# EAGLE design DACFINAL (EAGLE 5.07)
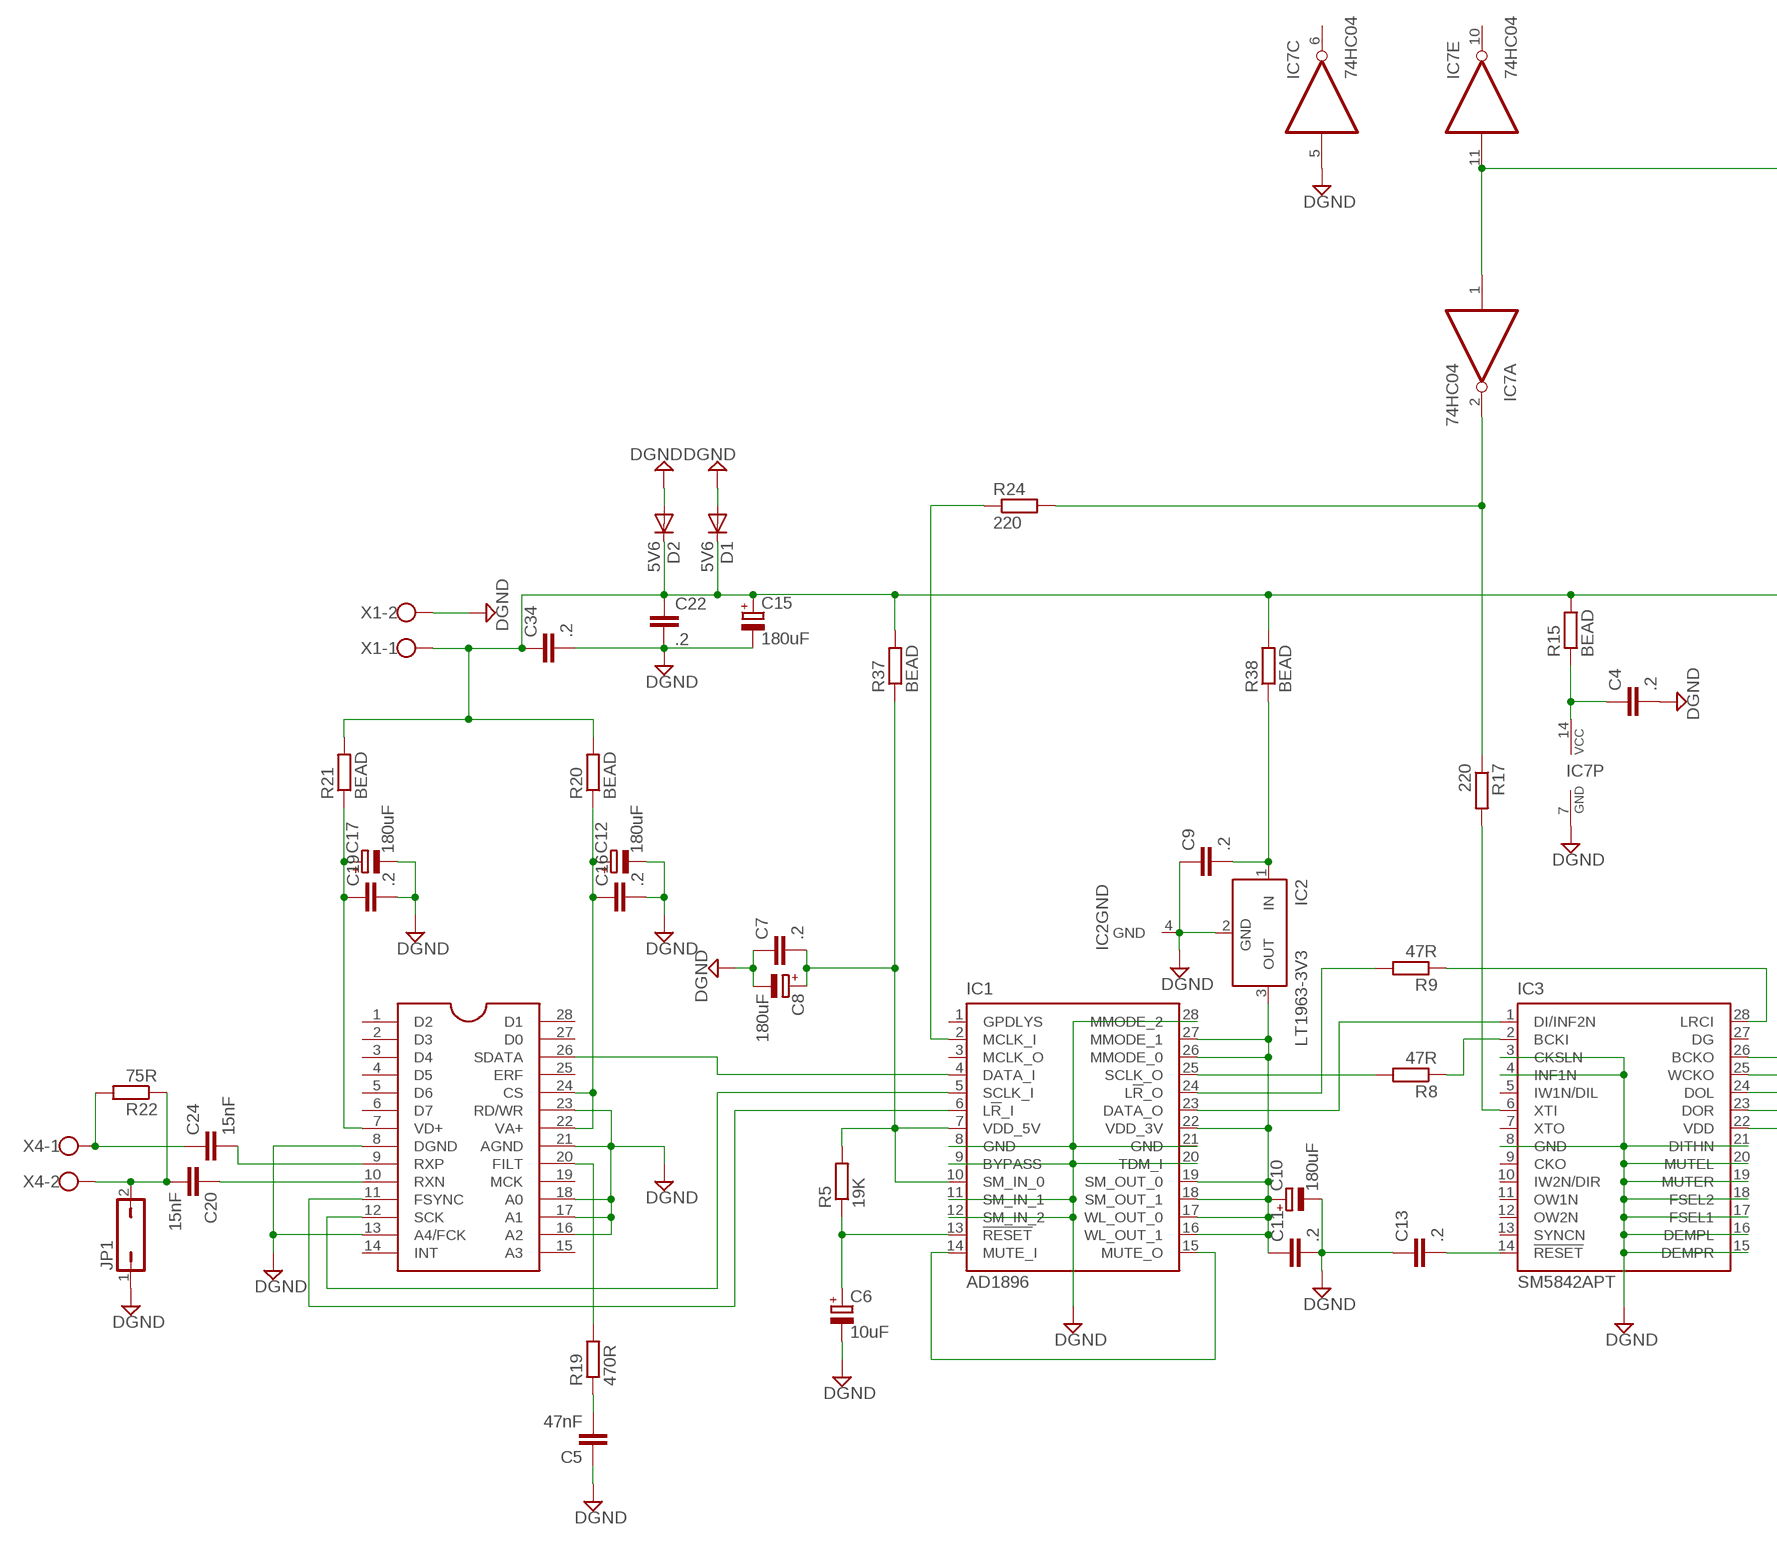
[diagram p0: schematic, sheet 1, part 1 of 2]
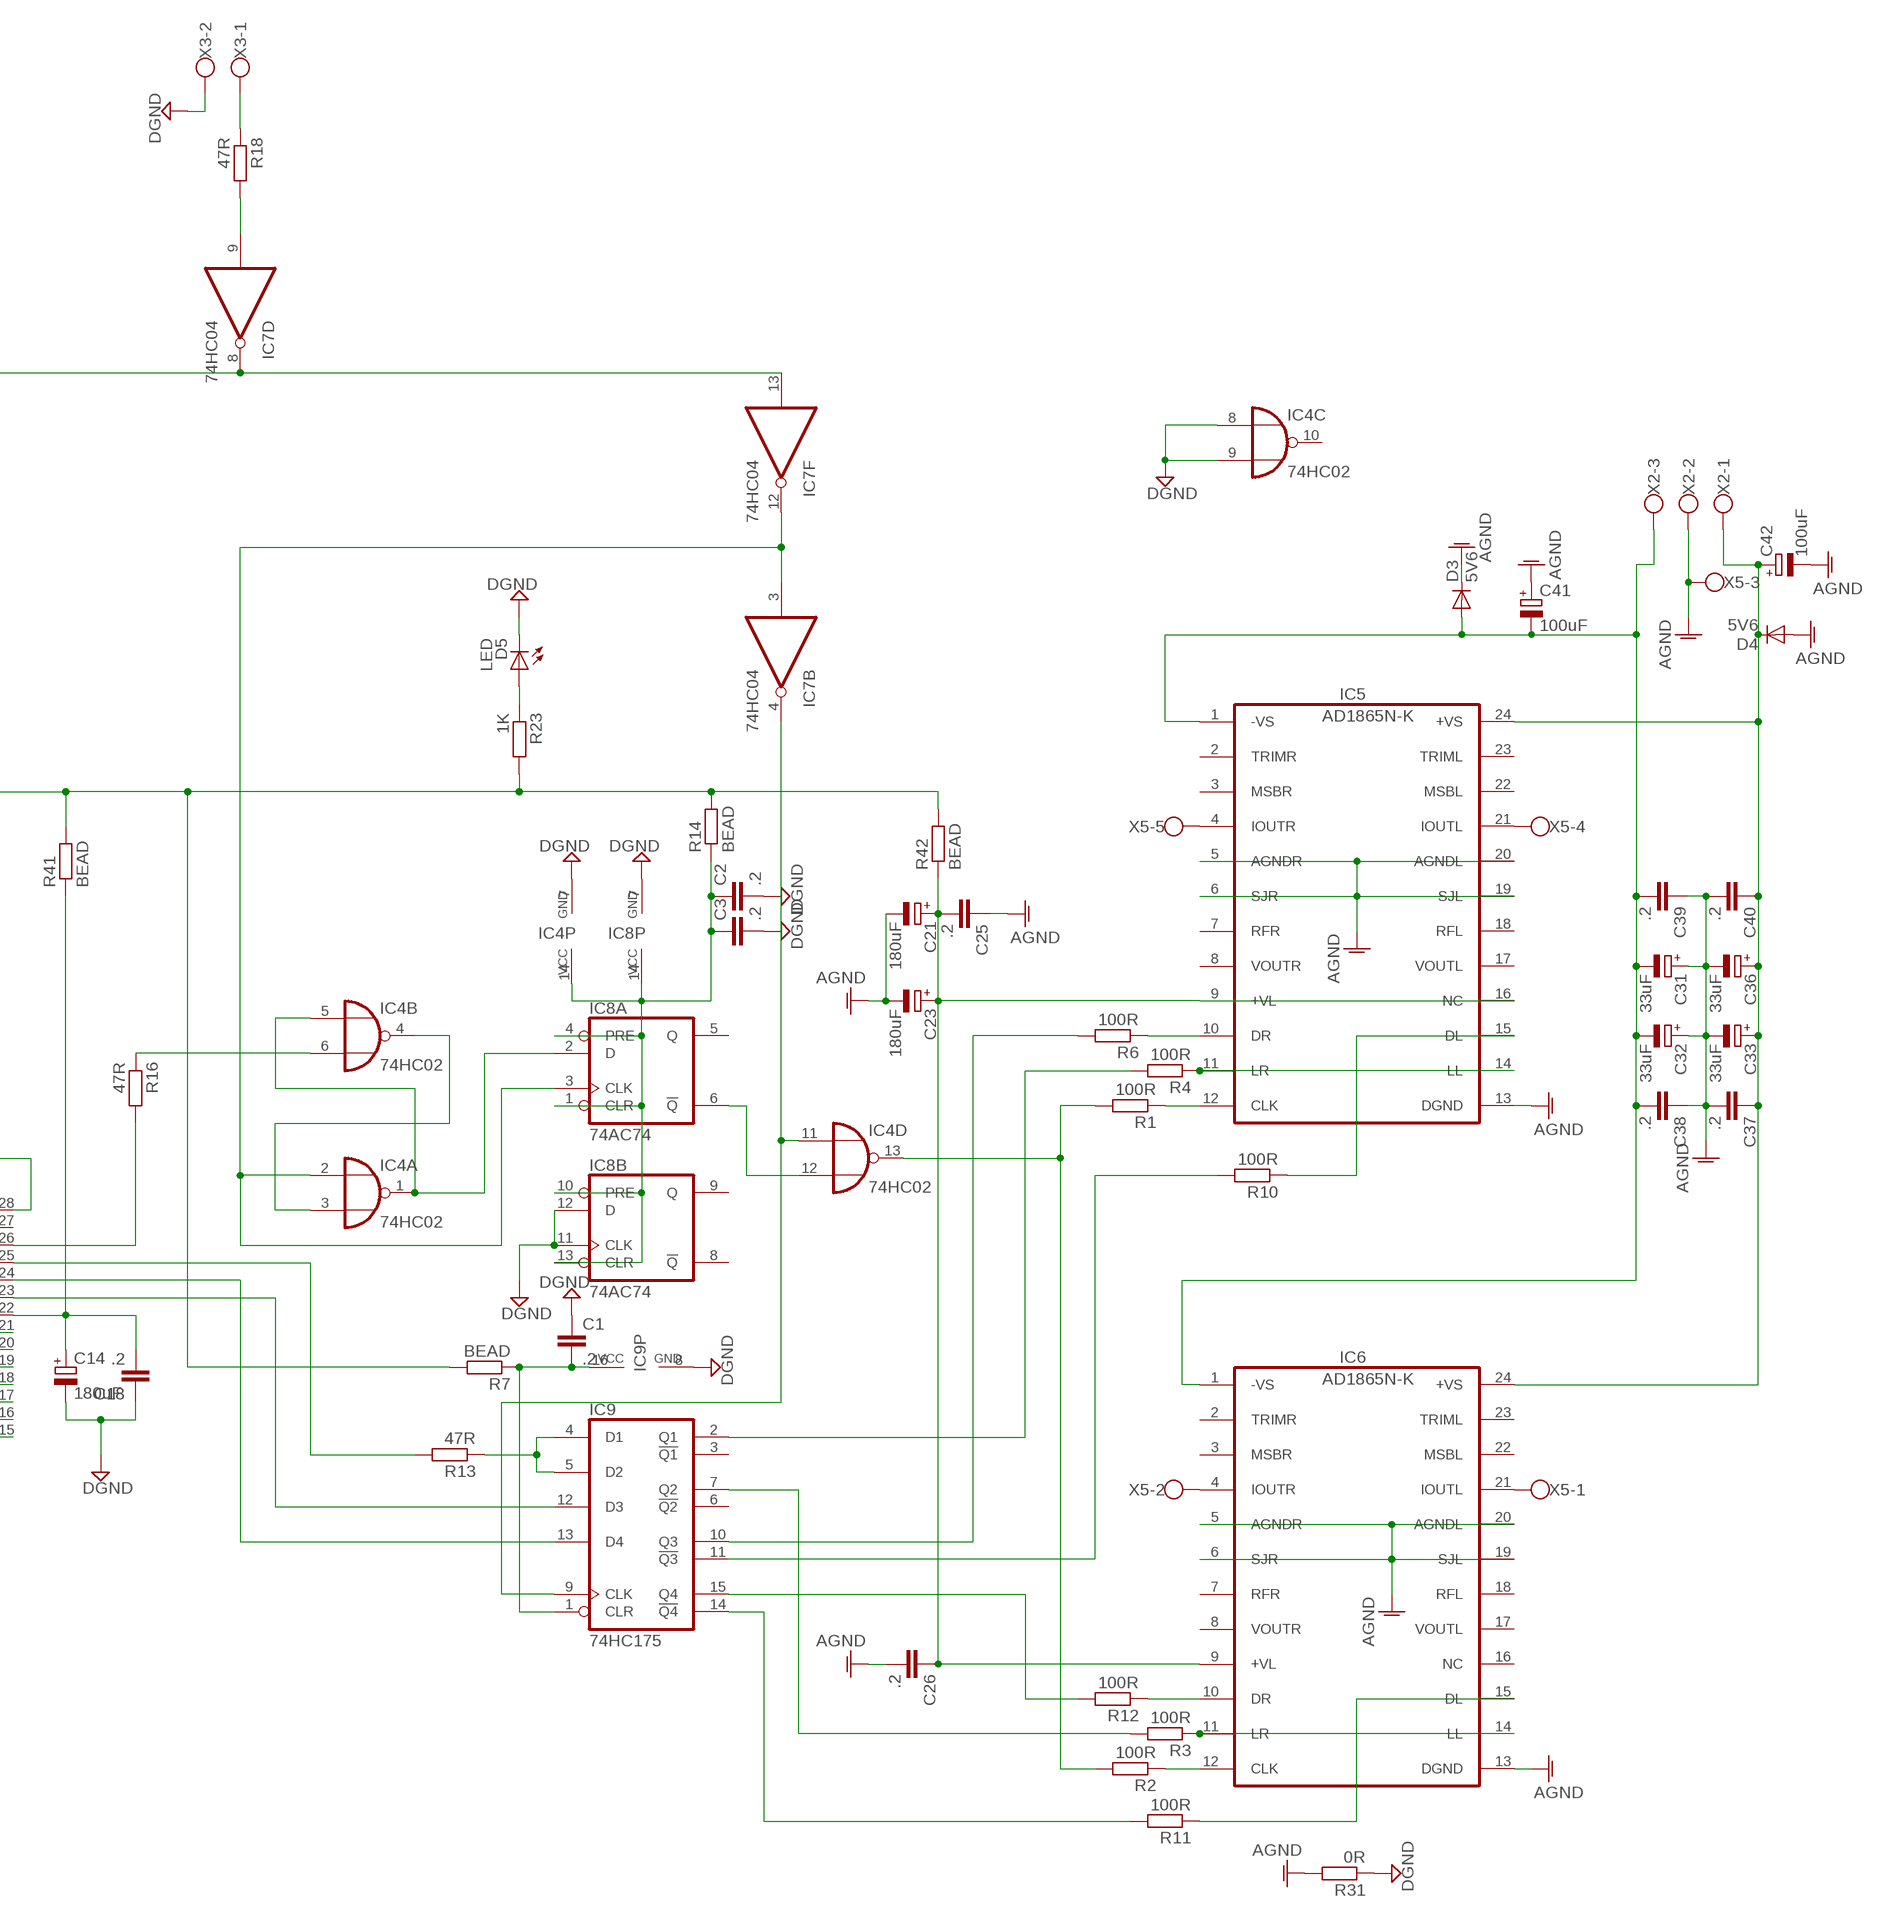
[diagram p1: schematic, sheet 1, part 2 of 2]

## Parts
C1  .2  C-EUC1210K  [C1210K]
C2  .2  C-EUC1210K  [C1210K]
C3  .2  C-EUC1210K  [C1210K]
C4  .2  C-EUC1210K  [C1210K]
C5  47nF  C-EU050-075X075  [C050-075X075]
C6  10uF  CPOL-EUE2.5-7  [E2,5-7]
C7  .2  C-EUC1210K  [C1210K]
C8  180uF  CPOL-EUE3.5-8  [E3,5-8]
C9  .2  C-EUC1210K  [C1210K]
C10  180uF  CPOL-EUE3.5-8  [E3,5-8]
C11  .2  C-EUC1210K  [C1210K]
C12  180uF  CPOL-EUE3.5-8  [E3,5-8]
C13  .2  C-EUC1210K  [C1210K]
C14  180uF  CPOL-EUE3.5-8  [E3,5-8]
C15  180uF  CPOL-EUE3.5-8  [E3,5-8]
C16  .2  C-EUC1210K  [C1210K]
C17  180uF  CPOL-EUE3.5-8  [E3,5-8]
C18  .2  C-EUC1210K  [C1210K]
C19  .2  C-EUC1210K  [C1210K]
C20  15nF  C-EU050-045X075  [C050-045X075]
C21  180uF  CPOL-EUE3.5-8  [E3,5-8]
C22  .2  C-EUC1210K  [C1210K]
C23  180uF  CPOL-EUE3.5-8  [E3,5-8]
C24  15nF  C-EU050-045X075  [C050-045X075]
C25  .2  C-EUC1210K  [C1210K]
C26  .2  C-EUC1210K  [C1210K]
C31  33uF  CPOL-EUE3.5-8  [E3,5-8]
C32  33uF  CPOL-EUE3.5-8  [E3,5-8]
C33  33uF  CPOL-EUE3.5-8  [E3,5-8]
C34  .2  C-EUC1210K  [C1210K]
C36  33uF  CPOL-EUE3.5-8  [E3,5-8]
C37  .2  C-EUC1210K  [C1210K]
C38  .2  C-EUC1210K  [C1210K]
C39  .2  C-EUC1210K  [C1210K]
C40  .2  C-EUC1210K  [C1210K]
C41  100uF  CPOL-EUE5-10.5  [E5-10,5]
C42  100uF  CPOL-EUE5-10.5  [E5-10,5]
D1  5V6  A114  [DO204-10]
D2  5V6  A114  [DO204-10]
D3  5V6  A114  [DO204-10]
D4  5V6  A114  [DO204-10]
D5  LED  SFH482  [SFH482]
IC1  AD1896  AD1896JN  [DIL28-6]
IC2  LT1963-3V3  LT1129CST5  [SOT223]
IC3  SM5842APT  SM5842JN  [DIL28-6]
IC4  74HC02  7402N  [DIL14]
IC5  AD1865N-K  AD1865  [DIL24-6]
IC6  AD1865N-K  AD1865  [DIL24-6]
IC7  74HC04  7404N  [DIL14]
IC8  74AC74  74AC74N  [DIL14]
IC9  74HC175  74175N  [DIL16]
JP1  JP1Q  [JP1]
R1  100R  R-EU_0204/7  [0204/7]
R2  100R  R-EU_0207/10  [0207/10]
R3  100R  R-EU_0204/7  [0204/7]
R4  100R  R-EU_0204/7  [0204/7]
R5  19K  R-EU_0204/7  [0204/7]
R6  100R  R-EU_0204/7  [0204/7]
R7  BEAD  R-EU_R1210  [R1210]
R8  47R  R-EU_0207/10  [0207/10]
R9  47R  R-EU_0207/10  [0207/10]
R10  100R  R-EU_0204/7  [0204/7]
R11  100R  R-EU_0204/7  [0204/7]
R12  100R  R-EU_0204/7  [0204/7]
R13  47R  R-EU_0204/7  [0204/7]
R14  BEAD  R-EU_R1210  [R1210]
R15  BEAD  R-EU_R1210  [R1210]
R16  47R  R-EU_0207/10  [0207/10]
R17  220  R-EU_0204/7  [0204/7]
R18  47R  R-EU_0204/7  [0204/7]
R19  470R  R-EU_0204/7  [0204/7]
R20  BEAD  R-EU_R1210  [R1210]
R21  BEAD  R-EU_R1210  [R1210]
R22  75R  R-EU_0204/7  [0204/7]
R23  1K  R-EU_R1210  [R1210]
R24  220  R-EU_R1210  [R1210]
R31  0R  R-EU_0207/10  [0207/10]
R37  BEAD  R-EU_R1210  [R1210]
R38  BEAD  R-EU_R1210  [R1210]
R41  BEAD  R-EU_R1210  [R1210]
R42  BEAD  R-EU_R1210  [R1210]
U$1  CS8412  CS8412DIP  [DIL28]
X1  W237-02P  [W237-132]
X2  W237-03P  [W237-133]
X3  W237-02P  [W237-132]
X4  W237-02P  [W237-132]
X5  W237-05P  [W237-5P]

## Nets
AGND: C21.- C23.- C25.1 C26.2 C31.+ C32.+ C33.- C36.- C37.2 C38.1 C39.1 C40.2 C41.+ C42.- D3.C D4.A IC5.5(AGNDR) IC5.6(SJR) IC5.13(DGND) IC5.19(SJL) IC5.20(AGNDL) IC6.5(AGNDR) IC6.6(SJR) IC6.13(DGND) IC6.19(SJL) IC6.20(AGNDL) R31.2 X2.2 X5.3
DGND: C1.1 C2.2 C3.2 C4.2 C5.1 C6.- C7.1 C8.- C9.1 C10.- C11.2 C12.- C13.1 C14.- C15.- C16.2 C17.- C18.1 C19.2 C22.2 C34.2 D1.A D2.A D5.K(C) IC1.8(GND) IC1.9(BYPASS) IC1.11(SM_IN_1) IC1.12(SM_IN_2) IC1.20(TDM_I) IC1.21(GND) IC1.28(MMODE_2) IC2.2(GND) IC2.4(GND) IC3.3(CKSLN) IC3.4(INF1N) IC3.8(GND) IC3.15(DEMPR) IC3.16(DEMPL) IC3.17(FSEL1) IC3.18(FSEL2) IC3.19(MUTER) IC3.20(MUTEL) IC3.21(DITHN) IC4.7(P:GND) IC4.8(C:I0) IC4.9(C:I1) IC7.5(C:I) IC7.7(P:GND) IC8.7(P:GND) IC8.11(B:CLK) IC8.12(B:D) IC9.8(GND) JP1.1 R31.1 U$1.8(DGND) U$1.13(A4/FCK) U$1.16(A2) U$1.17(A1) U$1.18(A0) U$1.21(AGND) U$1.23(RD/WR) X1.2 X3.2
N$1: IC6.12(CLK) R2.1
N$2: IC1.14(MUTE_I) IC1.15(MUTE_O)
N$3: IC4.13(D:O) R1.2 R2.2
N$5: IC1.4(DATA_I) U$1.26(SDATA)
N$6: IC1.5(SCLK_I) U$1.12(SCK)
N$7: IC1.6(L!R!_I) U$1.11(FSYNC)
N$8: C10.+ C11.1 IC1.16(WL_OUT_1) IC1.17(WL_OUT_0) IC1.18(SM_OUT_1) IC1.19(SM_OUT_0) IC1.22(VDD_3V) IC1.26(MMODE_0) IC1.27(MMODE_1) IC2.3(OUT)
N$9: C7.2 C8.+ IC1.7(VDD_5V) IC1.10(SM_IN_0) R5.2 R37.1
N$10: IC5.10(DR) R6.1
N$11: C9.2 IC2.1(IN) R38.1
N$12: IC5.15(DL) R10.1
N$14: IC6.10(DR) R12.1
N$15: IC6.15(DL) R11.1
N$16: IC9.7(Q2) R3.2
N$17: IC9.2(Q1) R4.2
N$18: IC4.2(A:I0) IC7.3(B:I) IC7.12(F:O) IC8.3(A:CLK)
N$19: IC9.4(D1) IC9.5(D2) R13.1
N$20: IC3.2(BCKI) R8.1
N$21: IC1.23(DATA_O) IC3.1(DI/INF2N)
N$22: IC1.25(SCLK_O) R8.2
N$23: C1.2 IC9.1(CLR) IC9.16(VCC) R7.1
N$24: IC3.25(WCKO) R13.2
N$25: IC9.15(Q4) R12.2
N$26: IC1.24(L!R!_O) R9.2
N$27: IC3.28(LRCI) R9.1
N$28: IC9.14(!Q4) R11.2
N$29: C13.2 IC3.14(!RESET)
N$30: C14.+ C18.2 IC3.22(VDD) R41.1
N$31: IC9.10(Q3) R6.2
N$32: IC9.11(!Q3) R10.2
N$33: IC1.2(MCLK_I) R24.1
N$34: IC3.6(XTI) R17.2
N$35: IC3.23(DOR) IC9.12(D3)
N$36: IC3.24(DOL) IC9.13(D4)
N$37: C2.1 C3.1 IC4.14(P:VCC) IC8.1(A:CLR) IC8.4(A:PRE) IC8.10(B:PRE) IC8.13(B:CLR) IC8.14(P:VCC) R14.1
N$38: IC4.12(D:I1) IC8.6(A:!Q)
N$39: IC4.11(D:I0) IC7.4(B:O) IC9.9(CLK)
N$40: IC4.1(A:O) IC4.5(B:I0) IC8.2(A:D)
N$41: IC4.3(A:I1) IC4.4(B:O)
N$44: IC4.6(B:I1) R16.1
N$45: IC3.26(BCKO) R16.2
N$47: IC7.1(A:I) IC7.8(D:O) IC7.11(E:I) IC7.13(F:I)
N$49: IC7.9(D:I) R18.2
N$50: C4.1 IC7.14(P:VCC) R15.1
N$51: IC7.2(A:O) R17.1 R24.2
N$52: R18.1 X3.1
N$53: C20.1 U$1.10(RXN)
N$55: IC6.11(LR) IC6.14(LL) R3.1
N$57: C24.2 U$1.9(RXP)
N$58: C17.+ C19.1 R21.1 U$1.7(VD+)
N$59: IC5.12(CLK) R1.1
N$60: C12.+ C16.1 R20.1 U$1.22(VA+) U$1.24(CS)
N$61: C5.2 R19.1
N$62: C21.+ C23.+ C25.2 C26.1 IC5.9(+VL) IC5.16(NC) IC6.9(+VL) R42.1
N$63: R19.2 U$1.20(FILT)
N$64: C24.1 R22.2 X4.1
N$65: C20.2 JP1.2 R22.1 X4.2
N$66: D5.A R23.1
N$71: IC5.11(LR) IC5.14(LL) R4.1
N$74: C31.- C32.- C38.2 C39.2 C41.- D3.A IC5.1(-VS) IC6.1(-VS) X2.3
N$76: IC5.4(IOUTR) X5.5
N$77: C33.+ C36.+ C37.1 C40.1 C42.+ D4.C IC5.24(+VS) IC6.24(+VS) X2.1
N$78: IC5.21(IOUTL) X5.4
N$79: IC6.21(IOUTL) X5.1
N$80: IC6.4(IOUTR) X5.2
N$82: C15.+ C22.1 C34.1 D1.C D2.C R7.2 R14.2 R15.2 R20.2 R21.2 R23.2 R37.2 R38.2 R41.2 R42.2 X1.1
N$89: C6.+ IC1.13(!RESET) R5.1
Unconnected: IC1.1(GPDLYS) IC1.3(MCLK_O) IC3.5(IW1N/DIL) IC3.7(XTO) IC3.9(CKO) IC3.10(IW2N/DIR) IC3.11(OW1N) IC3.12(OW2N) IC3.13(SYNCN) IC3.27(DG) IC4.10(C:O) IC5.2(TRIMR) IC5.3(MSBR) IC5.7(RFR) IC5.8(VOUTR) IC5.17(VOUTL) IC5.18(RFL) IC5.22(MSBL) IC5.23(TRIML) IC6.2(TRIMR) IC6.3(MSBR) IC6.7(RFR) IC6.8(VOUTR) IC6.16(NC) IC6.17(VOUTL) IC6.18(RFL) IC6.22(MSBL) IC6.23(TRIML) IC7.6(C:O) IC7.10(E:O) IC8.5(A:Q) IC8.8(B:!Q) IC8.9(B:Q) IC9.3(!Q1) IC9.6(!Q2) U$1.1(D2) U$1.2(D3) U$1.3(D4) U$1.4(D5) U$1.5(D6) U$1.6(D7) U$1.14(INT) U$1.15(A3) U$1.19(MCK) U$1.25(ERF) U$1.27(D0) U$1.28(D1)

## Library data of the parts
C1-C5 C7 C9 C11 C13 C16 C18-C20 C22 C24-C26 C34 C37-C40 = resistor:C-EU: CAPACITOR, European symbol
C6 C8 C10 C12 C14 C15 C17 C21 C23 C31-C33 C36 C41 C42 = resistor:CPOL-EU: POLARIZED CAPACITOR, European symbol
D1-D4 = diode:A114: DIODE germanium
D5 = led:SFH482: IR LED infrared emitting diode, Infineon
IC1 = analog-devices:AD1896: Stereo Asynchronous Sample Rate Converter Auto generated by make-symbol-device-package-bsdl.ulp Rev. 33 Source: http://www.analog.com/static/imported-files/data_sheets/AD1896.pdf
IC2 = linear-technology:LT1129CST5: VOLTAGE REGULATOR with shutdown
IC3 = analog-devices:SM5842: High-Class Audio Multi-function Digital Filter Source: http://www.dddac.de/files/SM5842.pdf
IC4 = 74xx-eu:74*02: Quad 2-input NOR gate
IC5 IC6 = pavouk:AD1865: Complete Dual 18-Bit 16xFS Audio DAC
IC7 = 74xx-eu:74*04: Hex INVERTER
IC8 = 74xx-eu:74*74: Dual D type positive edge triggered FLIP FLOP, preset and clear
IC9 = 74xx-eu:74*175: Qadruple D type FLIP FLOP, clear
JP1 = jumper:JP1Q: JUMPER
R1-R24 R31 R37 R38 R41 R42 = resistor:R-EU_: RESISTOR, European symbol
U$1 = cirrus-dar:CS8412: 24bit 55kHz Digital Audio Receiver
X1 X3 X4 = con-wago-508:W237-02P: WAGO SREW CLAMP
X2 = con-wago-508:W237-03P: WAGO SREW CLAMP
X5 = con-wago-508:W237-05P: WAGO SREW CLAMP

## Board
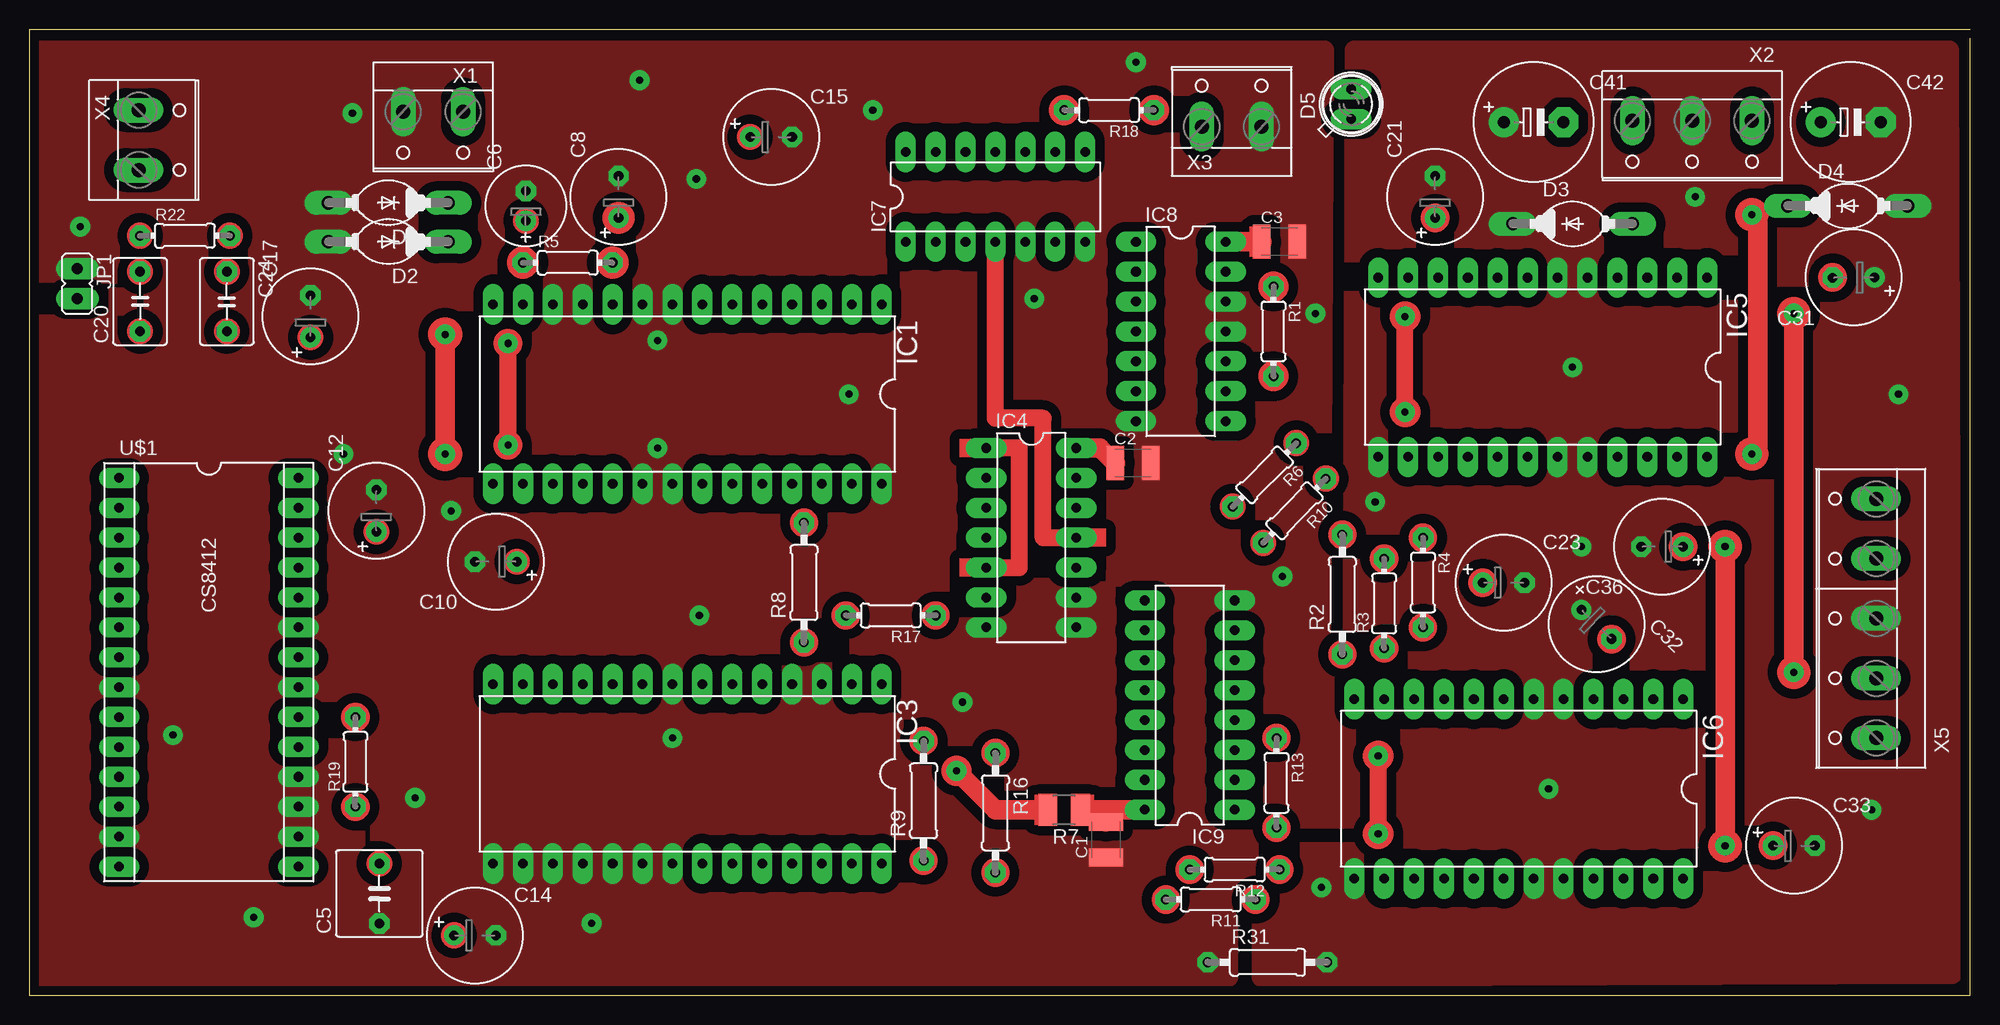
[diagram p2: board, top side]
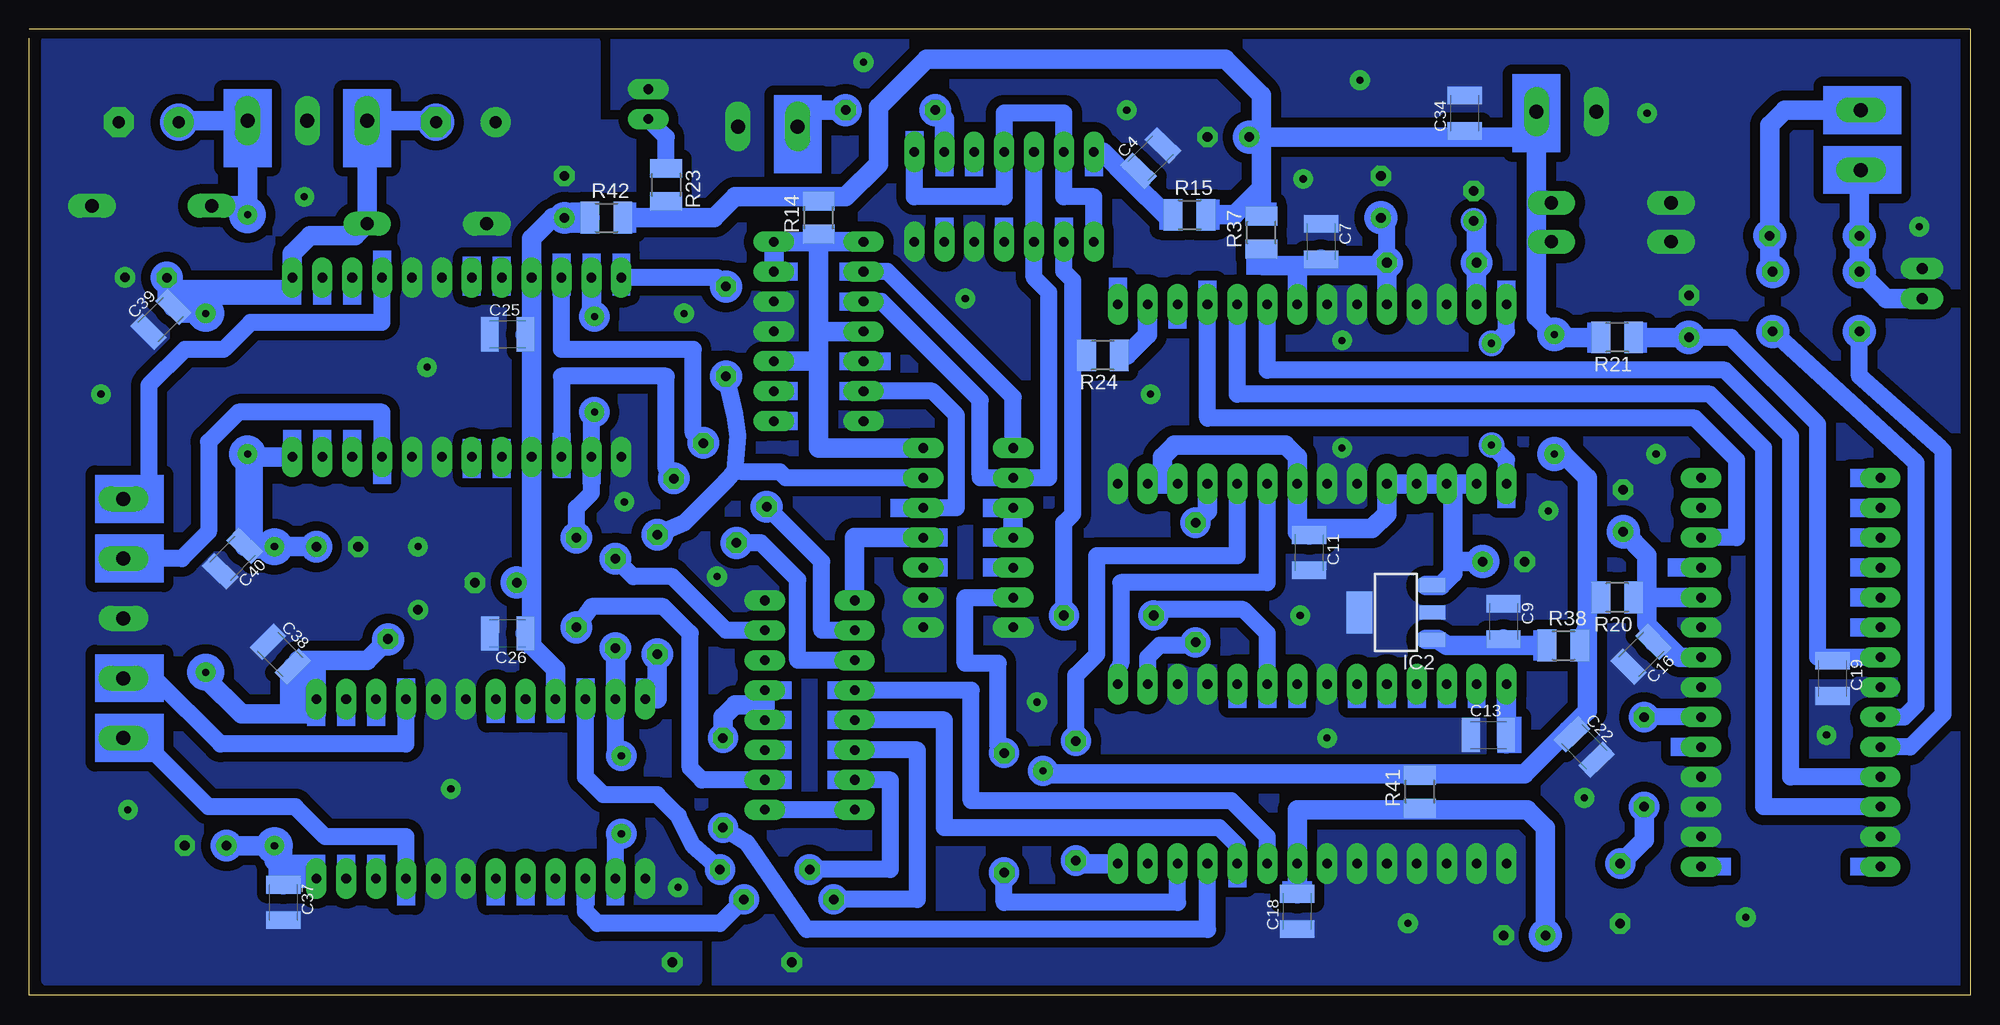
[diagram p3: board, bottom side, seen from below]

Size 164.83 x 82.04 mm. Coordinates in mm from the lower left corner, seen from the top.
Outline: 164.83,81.28 164.83,0 0,0 0,82.04 164.83,82.04
Copper layers (1*16): Top 0.035mm / dielectric 1.5mm / Bottom 0.035mm
Design rules "default *": minimum track width 10mil, minimum drill 24mil, track to track 8mil, track to pad 8mil, pad to pad 8mil, via to via 8mil, smd to smd 8mil, copper to edge 30mil, drill to drill 8mil, minimum pad ring 18mil, minimum via ring 8mil, stop-mask expansion 4mil, vias tented up to drill 0mil, thermal gap 10mil

### Footprints (pad centres in the part's own frame; a part is rotated, then mirrored left to right if it is on the bottom)
C1210K = smd 1.5 x 2.9: 1 -1.5,0; 2 1.5,0
C050-075X075 = drill 0.813 octagon: 1 -2.54,0; 2 2.54,0
E2,5-7 = drill 0.813 pad 1.6 round: + -1.27,0 | drill 0.813 pad 1.6 octagon: - 1.27,0
E3,5-8 = drill 0.813 pad 1.6 round: + -1.778,0 | drill 0.813 pad 1.6 octagon: - 1.778,0
C050-045X075 = drill 0.813 octagon: 1 -2.54,0; 2 2.54,0
E5-10,5 = drill 1.016 pad 2.54 round: + -2.54,0 | drill 1.016 pad 2.54 octagon: - 2.54,0
DO204-10 = drill 1.118 long: A 5.08,0; C -5.08,0
SFH482 = drill 0.813 long: A -1.27,0; K 1.27,0
DIL28-6 = drill 0.813 pad 1.676 long: 1 -16.51,-7.62; 2 -13.97,-7.62; 3 -11.43,-7.62; 4 -8.89,-7.62; 5 -6.35,-7.62; 6 -3.81,-7.62; 7 -1.27,-7.62; 8 1.27,-7.62; 9 3.81,-7.62; 10 6.35,-7.62; 11 8.89,-7.62; 12 11.43,-7.62; 13 13.97,-7.62; 14 16.51,-7.62; 15 16.51,7.62; 16 13.97,7.62; 17 11.43,7.62; 18 8.89,7.62; 19 6.35,7.62; 20 3.81,7.62; 21 1.27,7.62; 22 -1.27,7.62; 23 -3.81,7.62; 24 -6.35,7.62; 25 -8.89,7.62; 26 -11.43,7.62; 27 -13.97,7.62; 28 -16.51,7.62
SOT223 = smd 1.219 x 2.235: 1 -2.311,-3.099; 2 0,-3.099; 3 2.311,-3.099 | smd 3.6 x 2.2: 4 0,3.099
DIL14 = drill 0.813 long: 1 -7.62,-3.81; 2 -5.08,-3.81; 3 -2.54,-3.81; 4 0,-3.81; 5 2.54,-3.81; 6 5.08,-3.81; 7 7.62,-3.81; 8 7.62,3.81; 9 5.08,3.81; 10 2.54,3.81; 11 0,3.81; 12 -2.54,3.81; 13 -5.08,3.81; 14 -7.62,3.81
DIL24-6 = drill 0.813 long: 1 -13.97,-7.62; 2 -11.43,-7.62; 3 -8.89,-7.62; 4 -6.35,-7.62; 5 -3.81,-7.62; 6 -1.27,-7.62; 7 1.27,-7.62; 8 3.81,-7.62; 9 6.35,-7.62; 10 8.89,-7.62; 11 11.43,-7.62; 12 13.97,-7.62; 13 13.97,7.62; 14 11.43,7.62; 15 8.89,7.62; 16 6.35,7.62; 17 3.81,7.62; 18 1.27,7.62; 19 -1.27,7.62; 20 -3.81,7.62; 21 -6.35,7.62; 22 -8.89,7.62; 23 -11.43,7.62; 24 -13.97,7.62
DIL16 = drill 0.813 long: 1 -8.89,-3.81; 2 -6.35,-3.81; 3 -3.81,-3.81; 4 -1.27,-3.81; 5 1.27,-3.81; 6 3.81,-3.81; 7 6.35,-3.81; 8 8.89,-3.81; 9 8.89,3.81; 10 6.35,3.81; 11 3.81,3.81; 12 1.27,3.81; 13 -1.27,3.81; 14 -3.81,3.81; 15 -6.35,3.81; 16 -8.89,3.81
JP1 = drill 0.914 long: 1 0,-1.27; 2 0,1.27
0204/7 = drill 0.813 octagon: 1 -3.81,0; 2 3.81,0
0207/10 = drill 0.813 octagon: 1 -5.08,0; 2 5.08,0
R1210 = smd 1.6 x 2.7: 1 -1.4,0; 2 1.4,0
DIL28 = drill 0.813 pad 1.676 long: 1 -16.51,-7.62; 2 -13.97,-7.62; 3 -11.43,-7.62; 4 -8.89,-7.62; 5 -6.35,-7.62; 6 -3.81,-7.62; 7 -1.27,-7.62; 8 1.27,-7.62; 9 3.81,-7.62; 10 6.35,-7.62; 11 8.89,-7.62; 12 11.43,-7.62; 13 13.97,-7.62; 14 16.51,-7.62; 15 16.51,7.62; 16 13.97,7.62; 17 11.43,7.62; 18 8.89,7.62; 19 6.35,7.62; 20 3.81,7.62; 22 -1.27,7.62; 23 -3.81,7.62; 24 -6.35,7.62; 25 -8.89,7.62; 26 -11.43,7.62; 27 -13.97,7.62; 28 -16.51,7.62 | drill 0.813 pad 1.6 long: 21 1.27,7.62
W237-132 = drill 1.194 long: 1 -2.54,-0.635; 2 2.54,-0.635
W237-133 = drill 1.194 long: 1 -5.08,-0.635; 2 0,-0.635; 3 5.08,-0.635
W237-5P = drill 1.194 long: 1 -10.16,-0.635; 2 -5.08,-0.635; 3 0,-0.635; 4 5.08,-0.635; 5 10.16,-0.635

### Placement (x,y rotation side)
C1  91.44,13.21 90 top
C2  93.73,45.21 0 top
C3  106.17,64.01 0 top
C4  69.6,71.12 46.1 bottom
C5  29.72,8.64 90 top
C6  42.16,67.06 90 top
C7  55.12,64.01 270 bottom
C8  50.04,67.82 90 top
C9  39.62,31.75 270 bottom
C10  39.62,36.83 180 top
C11  56.13,37.59 269.8 bottom
C12  29.46,41.15 90 top
C13  40.89,22.1 0 bottom
C14  37.85,5.08 0 top
C15  62.99,72.9 0 top
C16  27.94,28.96 224.9 bottom
C17  23.88,57.66 90 top
C18  57.15,7.11 90 bottom
C19  11.68,26.92 270 bottom
C20  9.4,58.93 90 top
C21  119.38,67.82 90 top
C22  32.77,21.08 314 bottom
C23  125.22,35.05 0 top
C24  16.76,58.93 270 top
C25  124.21,56.13 0 bottom
C26  124.21,30.73 179.9 bottom
C31  154.94,60.96 180.2 top
C32  133.1,31.5 316.1 top
C33  149.86,12.7 0 top
C34  42.93,74.93 90 bottom
C36  138.68,38.1 180 top
C37  143.26,7.87 270 bottom
C38  143.51,28.96 315 bottom
C39  153.67,57.4 44.9 bottom
C40  147.57,37.08 226 bottom
C41  127.76,74.17 0 top
C42  154.69,74.17 0 top
D1  30.48,67.31 180 top
D2  30.48,64.01 180 top
D3  131.06,65.53 0 top
D4  154.43,67.06 0 top
D5  112.27,75.69 90 top
IC1  55.88,51.05 180 top
IC2  48.77,32.51 90 bottom
IC3  55.88,18.8 180 top
IC4  85.09,38.86 270 top
IC5  128.52,53.34 180 top
IC6  126.49,17.53 180 top
IC7  82.04,67.82 0 top
IC8  97.79,56.39 270 top
IC9  98.55,24.64 90 top
JP1  4.06,60.45 180 top
R1  105.66,56.39 270 top
R2  111.51,34.04 90 top
R3  115.06,33.27 90 top
R4  118.36,35.05 270 top
R5  45.72,62.23 0 top
R6  104.9,44.2 225 top
R7  87.88,15.75 180 top
R8  65.79,35.05 90 top
R9  75.95,16.51 90 top
R10  107.44,41.15 225.6 top
R11  100.33,8.13 180 top
R12  102.36,10.67 180 top
R13  105.92,18.03 270 top
R14  97.79,66.04 90 bottom
R15  66.29,66.29 0 bottom
R16  82.04,15.49 270 top
R17  73.15,32.26 180 top
R18  91.69,75.18 180 top
R19  27.69,19.81 90 top
R20  29.97,33.78 180 bottom
R21  29.97,55.88 180 bottom
R22  13.21,64.52 0 top
R23  110.74,68.83 270 bottom
R24  73.66,54.36 180 bottom
R31  105.16,2.79 0 top
R37  60.2,64.77 90 bottom
R38  34.54,29.72 0 bottom
R41  46.74,17.27 90 bottom
R42  115.82,66.04 0 bottom
U$1  15.24,27.43 270 top
X1  34.29,74.42 180 top
X2  141.22,73.66 180 top
X3  102.11,74.42 0 top
X4  9.91,72.64 270 top
X5  156.21,32 90 top

### Tracks (layer width: path | path; a pad name or v marks a point on that pad's centre or on a via)
AGND  (via drill 0.6 pad 1.68)
  other vias: 114.3,41.91 131.06,53.34 129.03,17.53 131.83,38.1 158.75,51.05 109.73,9.14 141.48,67.82 156.46,15.75
  pour Bottom (isolate 0.813, no thermals): 163.32,81.03 116.84,81.03 116.84,73.91 113.79,73.91 113.79,55.37 110.74,55.37 110.74,12.45 108.2,12.45 108.2,1.27 163.32,1.27
  pour Top (isolate 0.813, no thermals): 112.52,80.26 112.27,12.19 104.65,12.19 104.65,1.52 163.32,1.78 163.07,80.26
DGND  (via drill 0.6 pad 1.68)
  other vias: 56.9,32.26 54.61,21.84 47.75,6.1 56.64,69.34 53.34,55.63 53.34,46.48 69.6,51.05 85.34,59.18 71.63,75.18 27.43,74.93 4.32,65.28 12.19,22.1 19.05,6.6 32.77,16.76 26.67,45.97 51.82,77.72 79.25,24.89 109.22,57.91 35.81,41.15 106.43,35.56 93.98,79.25
  pour Bottom (isolate 0.838, rank 5, no thermals): 0.51,80.77 0.51,1.27 115.06,1.27 115.32,80.77
  pour Top (isolate 0.813, no thermals): -0.51,1.52 -0.51,80.26 109.98,80.26 109.73,28.7 112.27,28.7 112.27,14.99 106.43,14.99 106.17,14.73 101.85,7.87 101.85,1.52
N$1
  Bottom 1.676: IC6.12 111.51,25.15 R2.1
N$2  (via drill 0.6 pad 1.68)
  Top 1.422: v40.64,46.74 v40.64,55.37
  Bottom 1.422: v40.64,46.74 39.37,45.47 IC1.15 | v40.64,55.37 40.39,55.37 39.37,56.39 IC1.14
N$3
  Bottom 1.422: R2.2 109.22,40.13 105.66,43.69 104.89,44.57 | 104.89,44.57 104.65,47.5 104.9,49.28 R1.2 | 104.89,44.57 104.27,44.45 101.09,44.45 100.58,43.94 IC4.13
N$5
  Bottom 1.422: IC1.4 64.77,49.02 23.37,49.02 19.81,45.47 19.81,38.86 U$1.26
N$6
  Bottom 1.422: IC1.5 62.23,51.05 22.1,51.05 17.53,46.48 17.53,16 U$1.12
N$7
  Bottom 1.422: U$1.11 15.24,18.54 15.24,47.5 20.83,53.09 59.69,53.09 IC1.6
N$8
  Bottom 1.676: 43.94,43.43 IC1.16 | 43.94,43.43 IC1.17 IC1.18 IC1.19 49.53,40.89 50.8,39.62 56.64,39.62 57.15,40.13 | 57.15,40.13 IC1.22 57.15,45.72 58.17,46.74 67.56,46.74 68.58,45.72 68.58,43.43 | IC2.3 45.7,34.8 | 45.7,34.8 46.23,34.8 | 45.7,34.8 44.96,34.8 43.94,35.81 43.94,36.83 | 43.94,36.83 43.94,43.43 | 43.94,36.83 C10.+ | C11.1 57.15,39.35 57.15,40.13 | 68.58,43.43 IC1.26 | 68.58,43.43 IC1.27
N$9
  Bottom 1.422: C8.+ 49.53,65.53 R5.2
  Bottom 1.676: IC1.10 49.53,61.98 | 49.53,61.98 R5.2 | 57.15,61.98 IC1.7 | 49.53,61.98 55.12,61.98 | 55.12,61.98 57.15,61.98 | 55.12,61.98 C7.2 | 57.15,61.98 60.07,61.98 60.2,62.1 R37.1
N$10
  Bottom 1.422: R6.1 108.46,47.75 108.46,54.86 119.63,54.86 IC5.10
N$11
  Bottom 1.676: 45.19,30.23 IC2.1 | 45.19,30.23 46.23,30.23 | R38.1 39.62,29.72 | 39.62,29.72 44.45,29.72 45.19,30.23 | 39.62,29.72 C9.2
N$12
  Bottom 1.422: R10.1 110.74,44.7 110.74,52.58 119.63,52.58 IC5.15
N$14
  Bottom 1.422: IC6.10 117.6,18.54 116.08,17.02 111.51,17.02 109.73,15.24 108.46,12.7 R12.1
N$15
  Bottom 1.422: R11.1 106.17,6.1 116.59,6.1 117.6,7.11 IC6.15
N$16
  Bottom 1.422: R3.2 113.54,35.56 110.24,35.56 105.66,30.99 IC9.7
N$17
  Bottom 1.422: R4.2 117.09,33.02 111,33.02 108.71,30.73 108.71,19.3 107.7,18.29 IC9.2
N$18
  Bottom 1.422: 83.82,43.94 84.07,44.2 | IC8.3 92.46,58.93 84.07,50.55 84.07,44.2 | 83.82,43.94 IC4.2 78.23,43.94 78.23,59.69 79.5,60.96 IC7.3 IC7.12 | 83.82,43.94 84.07,43.94 84.07,44.2
N$19
  Bottom 1.676: IC9.4 102.36,24.64 | 102.36,24.64 IC9.5 | 102.36,24.64 104.9,24.64 105.92,23.62 R13.1
N$20
  Bottom 1.422: R8.1 66.04,29.72 68.83,29.72 69.85,28.7 IC3.2
N$21
  Bottom 1.422: IC1.23 59.69,35.05 72.14,35.05 72.14,28.19 72.39,27.69 IC3.1
N$22
  Bottom 1.422: R8.2 65.53,40.39
  Bottom 1.676: 65.53,40.39 64.77,41.15 IC1.25
N$23
  Top 1.676: R7.1 91.44,15.75 | 91.44,15.75 IC9.16 | 91.44,15.75 C1.2
  Bottom 1.422: IC9.16 IC9.1
N$24
  Bottom 1.422: IC3.25 64.77,5.59 98.81,5.59 103.89,12.95 R13.2
N$25
  Bottom 1.422: IC9.15 91.69,18.29 91.69,10.67 R12.2
N$26
  Bottom 1.422: R9.2 75.95,27.18 74.17,28.96 74.17,37.34 62.23,37.34 IC1.24
N$27
  Bottom 1.676: IC3.28 75.69,11.18 R9.1
N$28
  Bottom 1.422: IC9.14 89.41,20.83 89.41,8.13 R11.2
N$29
  Bottom 1.676: 39.37,22.61 IC3.14 | 39.37,22.61 39.37,21.34 | 39.37,22.61 39.39,22.58 C13.2
N$30
  Bottom 1.676: 46.74,15.75 57.15,15.75 IC3.22 C18.2 | 46.74,15.75 R41.1 | C14.+ 36.07,14.22 37.59,15.75 46.74,15.75
N$31
  Bottom 1.422: IC9.10 97.54,30.99 97.54,36.83 R6.2
N$32
  Bottom 1.422: IC9.11 99.57,28.45 99.57,35.31 102.69,38.43 R10.2
N$33
  Bottom 1.676: R24.1 71.63,54.36 69.85,56.13 IC1.2
N$34
  Bottom 1.422: IC3.6 59.69,30.73 61.72,32.77 69.09,32.77 69.34,32.51 R17.2
N$35
  Bottom 1.422: IC3.23 59.69,13.46 62.74,16.51 84.84,16.51 84.84,25.91 IC9.12
N$36
  Bottom 1.422: IC3.24 62.23,12.7 63.75,14.22 87.12,14.22 87.12,23.37 IC9.13
N$37
  Top 1.676: IC8.14 C3.1 | IC4.14 90.93,46.48 92.2,45.21 C2.1
  Bottom 1.676: IC4.14 97.79,46.48 97.79,53.85 | 97.79,53.85 IC8.10 | 97.79,56.39 IC8.4 | 97.79,53.85 97.79,56.39 | 97.79,64.01 IC8.1 | 97.79,56.39 97.79,64.01 | IC8.13 IC8.14 97.79,64.01 | 97.79,64.01 R14.1
N$38
  Bottom 1.422: IC4.12 86.11,41.4 86.11,49.28 88.14,51.31 IC8.6
N$39
  Top 1.422: IC4.11 86.11,38.86 86.11,49.02 82.04,49.02 IC7.4
  Bottom 1.676: IC9.9 94.74,38.86 IC4.11
N$40
  Top 1.422: IC4.5 84.07,36.32 84.07,46.48 IC4.1
  Bottom 1.422: IC4.1 81.28,50.8 91.95,61.47 IC8.2
N$41
  Bottom 1.676: IC4.4 IC4.3
N$44
  Bottom 1.422: R16.1 82.55,21.08 82.55,28.19 85.34,28.19 85.34,33.78 IC4.6
N$45
  Bottom 1.422: IC3.26 67.31,7.87 82.04,7.87 R16.2
N$47
  Bottom 1.422: IC7.1 74.42,67.82 76.96,67.82 IC7.13 76.96,74.93 82.04,74.93 IC7.11 82.04,67.82 89.66,67.82 IC7.8
N$49
  Bottom 1.422: 87.63,74.93 R18.2
  Bottom 1.676: 87.63,74.93 87.12,74.42 IC7.9
N$50
  Bottom 1.422: C4.1 71.71,69.72 71.25,69.22
  Bottom 1.676: R15.1 68.33,66.29 71.25,69.22 73.66,71.63 IC7.14
N$51
  Bottom 1.422: 76.2,54.36 76.2,60.71 76.96,61.47 IC7.2 | 76.2,54.36 R24.2 | 76.2,54.36 76.2,40.89 76.96,40.13 R17.1
N$52
  Bottom 1.676: R18.1 98.17,75.18 X3.1
N$53
  Bottom 1.422: U$1.10 5.08,21.08 2.29,23.88 2.29,46.23 2.54,46.48 9.4,52.58 C20.1
N$55  (via drill 0.6 pad 1.68)
  Top 1.422: v114.55,13.72 v114.55,20.32
  Bottom 1.422: v114.55,20.32 115.06,20.83 IC6.11 | IC6.14 115.06,13.21 v114.55,13.72
  Bottom 1.676: IC6.14 115.06,9.4 | IC6.11 R3.1
N$57
  Bottom 1.422: U$1.9 5.59,23.62 4.57,24.64 4.57,45.21 C24.2
N$58
  Bottom 1.422: U$1.7 12.95,28.7 | 12.95,28.7 12.95,48.51 20.32,55.88 C17.+ | 11.18,28.68 C19.1 12.19,28.68 12.95,28.7
  Bottom 1.676: C17.+ R21.1
N$59
  Bottom 1.422: R1.1 106.43,60.96 IC5.12
  Bottom 1.676: IC5.12 114.55,61.21
N$60
  Bottom 1.676: U$1.22 24.64,28.7 26.29,30.35 | 29.08,39.37 C12.+ 27.43,37.34 27.43,33.78 | C16.1 26.54,30.35 26.29,30.35 | 26.29,30.35 27.43,31.5 27.43,33.78 | 27.43,33.78 U$1.24 | 27.43,33.78 R20.1
N$61
  Bottom 1.676: C5.2 27.69,13.21 R19.1
N$62
  Bottom 1.676: 122.17,56.39 IC5.16 122.17,35.05 | 122.17,56.39 IC5.9 | IC5.9 | 122.17,56.39 C25.2 | 122.17,35.05 C23.+ | IC6.9 120.14,27.69 122.17,29.72 | 122.17,29.72 122.17,35.05 | 122.17,29.72 122.45,30.73 C26.1 | IC5.9 122.17,64.26 120.4,66.04 C21.+ R42.1
N$63
  Bottom 1.422: U$1.20 R19.2
N$64
  Bottom 1.422: R22.2 16.76,64.26
  Bottom 1.676: X4.1 15.75,75.18 17.02,73.91 R22.2 17.02,61.72 C24.1
N$65
  Bottom 1.422: 9.4,68.96 X4.2
  Bottom 1.676: 9.4,68.96 R22.1 C20.2 7.11,59.18 JP1.2
N$66
  Bottom 1.422: D5.A 110.74,72.9 R23.1
N$70  (via drill 0.6 pad 1.68)
  other vias: 149.86,57.91
N$71  (via drill 0.6 pad 1.68)
  Top 1.422: v116.84,49.53 v116.84,57.66
  Bottom 1.422: v116.84,57.66 117.09,57.4 | v116.84,49.53 117.09,49.28 IC5.14 117.09,42.67 118.36,41.4 R4.1
  Bottom 1.676: 117.09,57.4 IC5.11
N$74  (via drill 0.6, 0.6 pad 1.68)
  Top 1.676: v149.86,27.43 v149.86,57.91
  Bottom 1.676: C41.- 130.43,74.3 X2.3 D3.A 137.16,64.52 140.97,64.52 142.49,62.99 IC5.1 142.49,60.2 142.75,59.94 152.15,59.94 | 152.15,59.94 152.4,59.94 152.65,60.2 | 152.65,60.2 153.16,60.71 C31.- | C39.2 152.15,58.93 152.65,59.44 152.65,60.2 | 140.46,26.16 140.46,27.94 141.99,28.45 136.14,28.45 134.62,29.97 C32.- | 140.46,26.16 IC6.1 140.46,23.88 141.48,23.88 | 140.46,26.16 141.22,26.16 | 141.48,23.88 146.81,23.88 149.86,26.92 v149.86,27.43 | C38.2 141.48,26.67 141.48,23.88 | 152.15,59.94 152.15,59.69 151.64,59.69 v149.86,57.91
N$76
  Bottom 1.422: X5.5 156.21,42.16 154.69,43.69 154.69,51.82 151.64,54.86 148.34,54.86 146.05,57.15 134.87,57.15 IC5.4
N$77  (via drill 0.6 pad 1.68)
  Top 1.676: v144.02,12.7 v144.02,38.1 | v146.3,66.29 146.81,65.79 146.81,46.48 v146.3,45.97
  Bottom 1.676: C42.+ 152.02,74.3 X2.1 v146.3,66.29 146.3,67.06 D4.C | IC5.24 145.29,45.72 146.18,44.83 | 146.18,44.83 146.3,44.7 | IC6.24 142.49,9.91 | 142.49,9.91 144.02,11.43 v144.02,12.7 C33.+ | C37.1 143.26,9.4 142.75,9.91 142.49,9.91 | C36.+ v144.02,38.1 146.53,38.1 C40.1 146.3,38.39 146.3,39.12 146.56,39.12 146.3,39.37 v146.3,45.97 146.18,45.97 146.18,44.83
N$78
  Bottom 1.422: IC5.21 134.87,49.53 147.07,49.53 149.61,46.99 149.61,39.37 151.89,37.08 X5.4
N$79
  Bottom 1.422: X5.1 155.45,21.84 149.61,16 142.24,16 139.7,13.46 132.84,13.46 IC6.21
N$80
  Bottom 1.422: IC6.4 132.84,21.34 148.59,21.34 154.18,26.92 X5.2
N$82  (via drill 0.6 pad 1.68)
  Top 1.676: v78.74,19.05 82.04,15.75 R7.2 | v35.31,45.97 v35.31,56.13
  Bottom 1.422: 78.74,18.8 v78.74,19.05 | 46.74,18.8 R41.2 | C22.1 34.13,22.48 34.16,22.48 | C34.1 42.93,72.92 49.78,72.9 | R23.2 110.74,66.29 111,66.04
  Bottom 1.676: R42.2 111,66.04 106.68,66.04 104.9,67.82 97.79,67.82 | 97.79,67.82 R14.2 | 32.51,31.24 R38.2 | 32.51,31.24 32.51,24.13 34.16,22.48 37.85,18.8 46.74,18.8 78.74,18.8 | 36.83,72.9 49.78,72.9 60.2,72.9 | 60.2,72.9 60.2,68.58 | 60.2,68.58 R37.2 | 36.83,64.01 36.83,57.66 v35.31,56.13 35.05,55.88 R21.2 | 36.83,64.01 36.83,67.82 | 36.83,67.82 36.83,72.9 | 32.51,31.24 32.51,33.78 | 32.51,33.78 32.51,43.94 34.54,45.97 v35.31,45.97 | 60.2,72.9 C15.+ | 60.2,72.9 60.2,76.45 63.25,79.5 88.65,79.5 92.71,75.44 92.71,70.61 95.5,67.82 97.79,67.82 | 32.51,33.78 R20.2 | 36.83,64.01 D2.C | 36.83,72.9 X1.1 | 35.05,67.31 D1.C 36.83,67.82 | R15.2 62.48,66.29 60.2,68.58
N$89
  Bottom 1.676: C6.+ 41.91,65.53 R5.1 IC1.13
(copper drawn outside any net)
  shapes: Bottom area x150, Bottom circle x88, Top area x9, Top circle x89